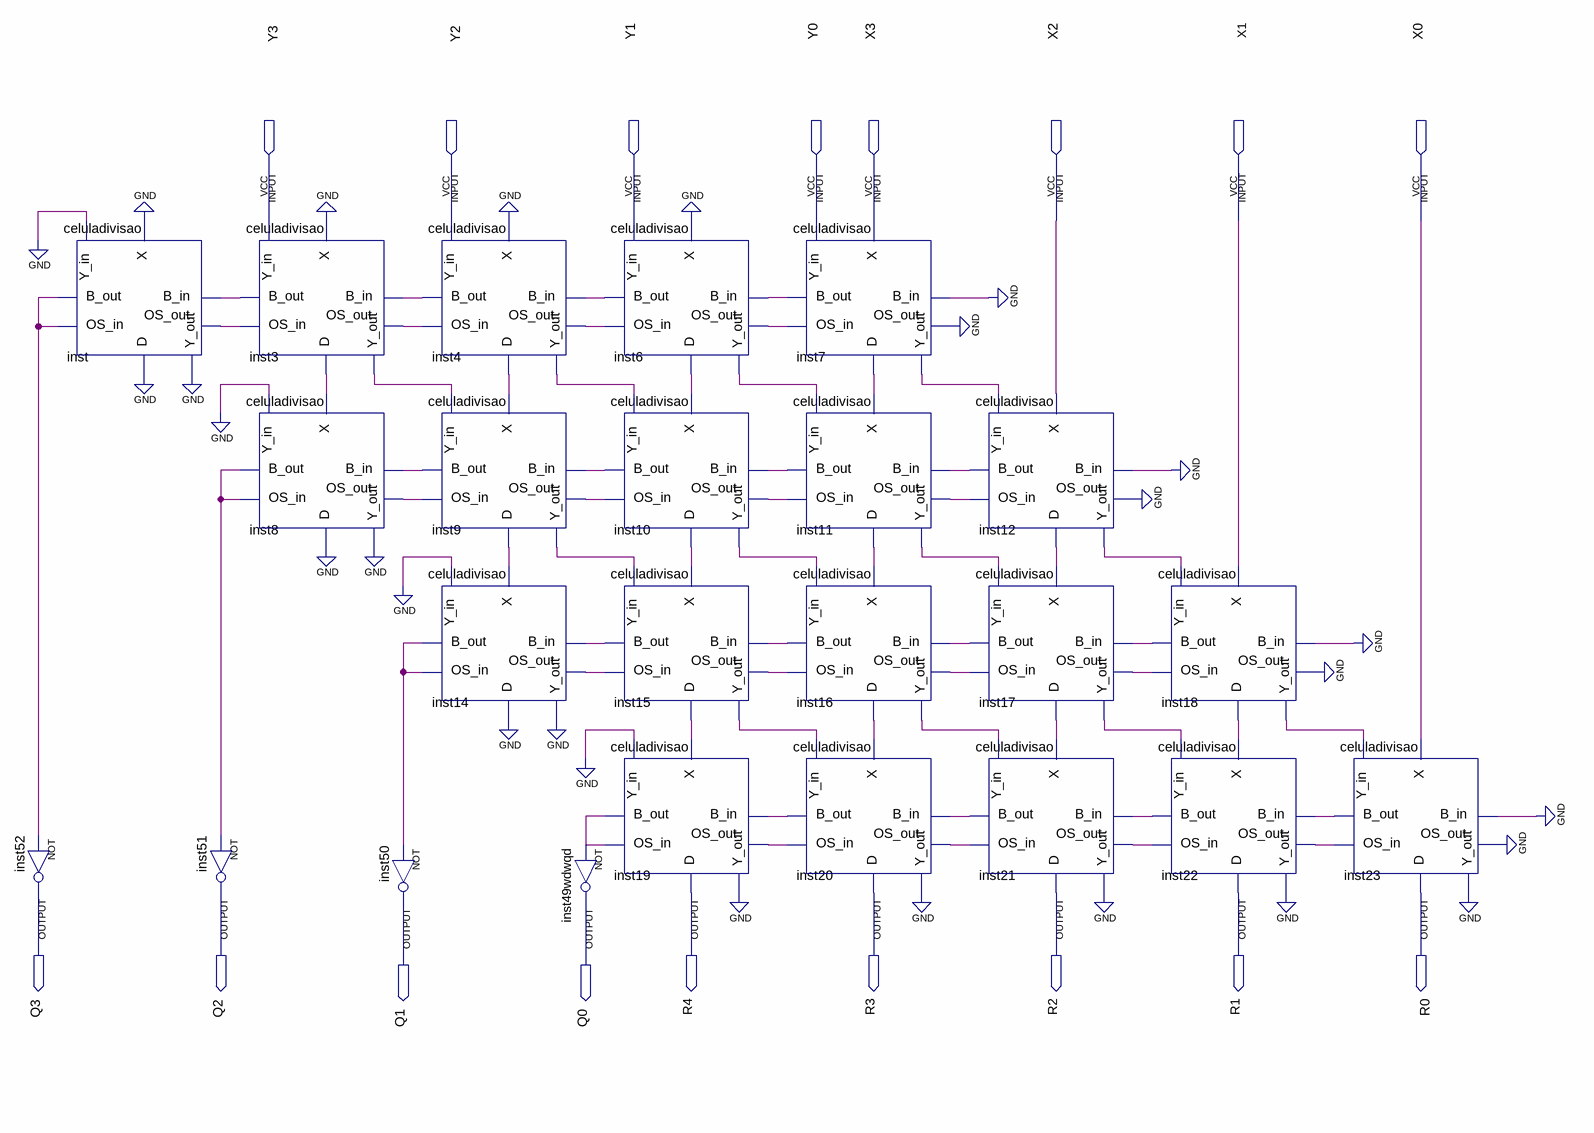
[diagram p0: schematic sheet]
// Quartus schematic divisorquatrobits.bdf as structural Verilog: 24 symbols, 17 pins
module divisorquatrobits (
  input  Y3,
  input  Y2,
  input  Y1,
  input  Y0,
  input  X3,
  input  X2,
  input  X1,
  input  X0,
  output Q3,
  output Q2,
  output R4,
  output R3,
  output R2,
  output R1,
  output R0,
  output Q1,
  output Q0
);

  wire inst3_b_out, inst3_d, inst3_os_out, inst3_y_out, inst4_b_out, inst4_d, inst4_os_out, inst4_y_out,
       inst6_b_out, inst6_d, inst6_os_out, inst6_y_out, inst7_b_out, inst7_d, inst7_os_out, inst7_y_out,
       inst8_b_out, inst8_d, inst8_os_out, inst8_y_out, inst9_b_out, inst9_d, inst9_os_out, inst9_y_out,
       inst10_b_out, inst10_d, inst10_os_out, inst10_y_out, inst11_b_out, inst11_d, inst11_os_out,
       inst11_y_out, inst12_b_out, inst12_d, inst12_os_out, inst12_y_out, inst14_b_out, inst14_d,
       inst14_os_out, inst14_y_out, inst15_b_out, inst15_d, inst15_os_out, inst15_y_out, inst16_b_out,
       inst16_d, inst16_os_out, inst16_y_out, inst17_b_out, inst17_d, inst17_os_out, inst17_y_out,
       inst18_b_out, inst18_d, inst18_os_out, inst18_y_out, inst19_b_out, inst19_os_out, inst19_y_out,
       inst20_b_out, inst20_os_out, inst20_y_out, inst21_b_out, inst21_os_out, inst21_y_out, inst22_b_out,
       inst22_os_out, inst22_y_out, inst23_b_out, inst23_os_out, inst23_y_out, inst_b_out, inst_d,
       inst_os_out, inst_y_out;

  not inst52 (Q3, inst_b_out);
  celuladivisao inst (
    .X(1'b0), .Y_in(1'b0), .B_in(inst3_b_out), .OS_in(inst_b_out), .B_out(inst_b_out), .OS_out(inst_os_out),
    .D(inst_d), .Y_out(inst_y_out));
  not inst51 (Q2, inst8_b_out);
  celuladivisao inst3 (
    .X(1'b0), .Y_in(Y3), .B_in(inst4_b_out), .OS_in(inst_os_out), .B_out(inst3_b_out), .OS_out(inst3_os_out),
    .D(inst3_d), .Y_out(inst3_y_out));
  celuladivisao inst8 (
    .X(inst3_d), .Y_in(1'b0), .B_in(inst9_b_out), .OS_in(inst8_b_out), .B_out(inst8_b_out),
    .OS_out(inst8_os_out), .D(inst8_d), .Y_out(inst8_y_out));
  celuladivisao inst4 (
    .X(1'b0), .Y_in(Y2), .B_in(inst6_b_out), .OS_in(inst3_os_out), .B_out(inst4_b_out),
    .OS_out(inst4_os_out), .D(inst4_d), .Y_out(inst4_y_out));
  celuladivisao inst9 (
    .X(inst4_d), .Y_in(inst3_y_out), .B_in(inst10_b_out), .OS_in(inst8_os_out), .B_out(inst9_b_out),
    .OS_out(inst9_os_out), .D(inst9_d), .Y_out(inst9_y_out));
  celuladivisao inst14 (
    .X(inst9_d), .Y_in(1'b0), .B_in(inst15_b_out), .OS_in(inst14_b_out), .B_out(inst14_b_out),
    .OS_out(inst14_os_out), .D(inst14_d), .Y_out(inst14_y_out));
  not inst50 (Q1, inst14_b_out);
  not inst49wdwqd (Q0, inst19_b_out);
  celuladivisao inst6 (
    .X(1'b0), .Y_in(Y1), .B_in(inst7_b_out), .OS_in(inst4_os_out), .B_out(inst6_b_out),
    .OS_out(inst6_os_out), .D(inst6_d), .Y_out(inst6_y_out));
  celuladivisao inst10 (
    .X(inst6_d), .Y_in(inst4_y_out), .B_in(inst11_b_out), .OS_in(inst9_os_out), .B_out(inst10_b_out),
    .OS_out(inst10_os_out), .D(inst10_d), .Y_out(inst10_y_out));
  celuladivisao inst15 (
    .X(inst10_d), .Y_in(inst9_y_out), .B_in(inst16_b_out), .OS_in(inst14_os_out), .B_out(inst15_b_out),
    .OS_out(inst15_os_out), .D(inst15_d), .Y_out(inst15_y_out));
  celuladivisao inst19 (
    .X(inst15_d), .Y_in(1'b0), .B_in(inst20_b_out), .OS_in(inst19_b_out), .B_out(inst19_b_out),
    .OS_out(inst19_os_out), .D(R4), .Y_out(inst19_y_out));
  celuladivisao inst7 (
    .X(X3), .Y_in(Y0), .B_in(1'b0), .OS_in(inst6_os_out), .B_out(inst7_b_out), .OS_out(inst7_os_out),
    .D(inst7_d), .Y_out(inst7_y_out));
  celuladivisao inst11 (
    .X(inst7_d), .Y_in(inst6_y_out), .B_in(inst12_b_out), .OS_in(inst10_os_out), .B_out(inst11_b_out),
    .OS_out(inst11_os_out), .D(inst11_d), .Y_out(inst11_y_out));
  celuladivisao inst16 (
    .X(inst11_d), .Y_in(inst10_y_out), .B_in(inst17_b_out), .OS_in(inst15_os_out), .B_out(inst16_b_out),
    .OS_out(inst16_os_out), .D(inst16_d), .Y_out(inst16_y_out));
  celuladivisao inst20 (
    .X(inst16_d), .Y_in(inst15_y_out), .B_in(inst21_b_out), .OS_in(inst19_os_out), .B_out(inst20_b_out),
    .OS_out(inst20_os_out), .D(R3), .Y_out(inst20_y_out));
  celuladivisao inst12 (
    .X(X2), .Y_in(inst7_y_out), .B_in(1'b0), .OS_in(inst11_os_out), .B_out(inst12_b_out),
    .OS_out(inst12_os_out), .D(inst12_d), .Y_out(inst12_y_out));
  celuladivisao inst17 (
    .X(inst12_d), .Y_in(inst11_y_out), .B_in(inst18_b_out), .OS_in(inst16_os_out), .B_out(inst17_b_out),
    .OS_out(inst17_os_out), .D(inst17_d), .Y_out(inst17_y_out));
  celuladivisao inst21 (
    .X(inst17_d), .Y_in(inst16_y_out), .B_in(inst22_b_out), .OS_in(inst20_os_out), .B_out(inst21_b_out),
    .OS_out(inst21_os_out), .D(R2), .Y_out(inst21_y_out));
  celuladivisao inst18 (
    .X(X1), .Y_in(inst12_y_out), .B_in(1'b0), .OS_in(inst17_os_out), .B_out(inst18_b_out),
    .OS_out(inst18_os_out), .D(inst18_d), .Y_out(inst18_y_out));
  celuladivisao inst22 (
    .X(inst18_d), .Y_in(inst17_y_out), .B_in(inst23_b_out), .OS_in(inst21_os_out), .B_out(inst22_b_out),
    .OS_out(inst22_os_out), .D(R1), .Y_out(inst22_y_out));
  celuladivisao inst23 (
    .X(X0), .Y_in(inst18_y_out), .B_in(1'b0), .OS_in(inst22_os_out), .B_out(inst23_b_out),
    .OS_out(inst23_os_out), .D(R0), .Y_out(inst23_y_out));
  // also tied to GND on the sheet: {inst_d, inst_y_out, inst8_d, inst8_y_out, inst14_d, inst14_y_out, inst19_y_out, inst20_y_out, inst7_os_out, inst21_y_out, inst12_os_out, inst22_y_out, inst18_os_out, inst23_y_out, inst23_os_out}
endmodule
